# EAGLE schematic Relay Driver (EAGLE 7.1.0)
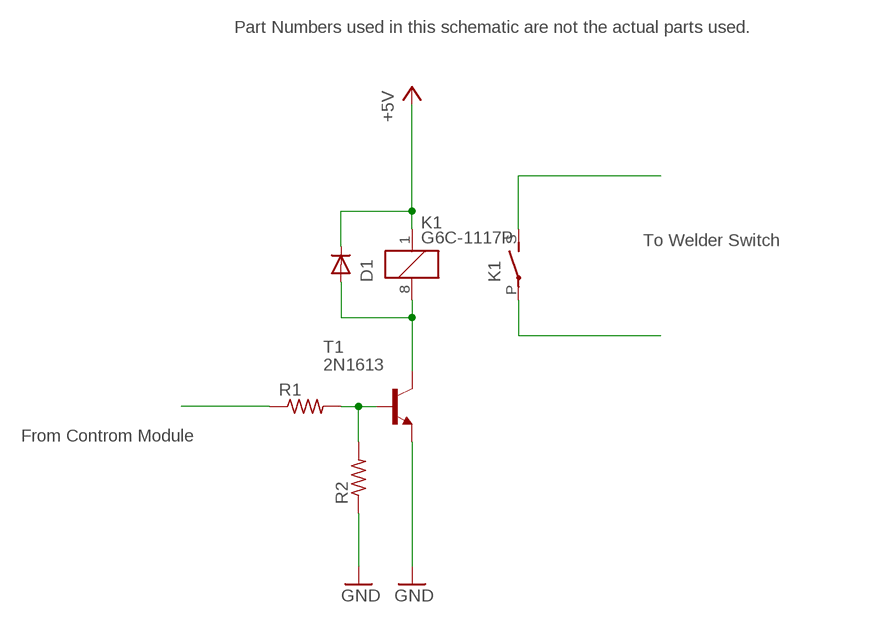
[diagram p0: schematic, sheet 1]

## Parts
D1  1N4004  [DO41-10]
K1  G6C-1117P  [G6C-1117P]
R1  R-US_0207/7  [0207/7]
R2  R-US_0207/7  [0207/7]
T1  2N1613  [TO5]

## Nets
+5V: D1.C K1.1
GND: R2.1
N$2: D1.A K1.8 T1.3(C)
N$3: T1.1(E) ; supply symbol labelled GND
N$4: K1.S(2:S)
N$5: K1.P(2:P)
N$8: R1.2 R2.2 T1.2(B)
N$10: R1.1

## Notes on the sheet
- Part Numbers used in this schematic are not the actual parts used.
- To Welder Switch
- From Controm Module

## Library data of the parts
D1 = diode:1N4004: DIODE general purpose rectifier, 1 A
K1 = relay:G6C-1117P: RELAY 1 x norm. open, 10 A/240 V, Omron; OC_FARNELL: unknown; OC_NEWARK: unknown
R1 R2 = rcl:R-US_: RESISTOR, American symbol
T1 = transistor:2N1613: NPN TRANSISTOR